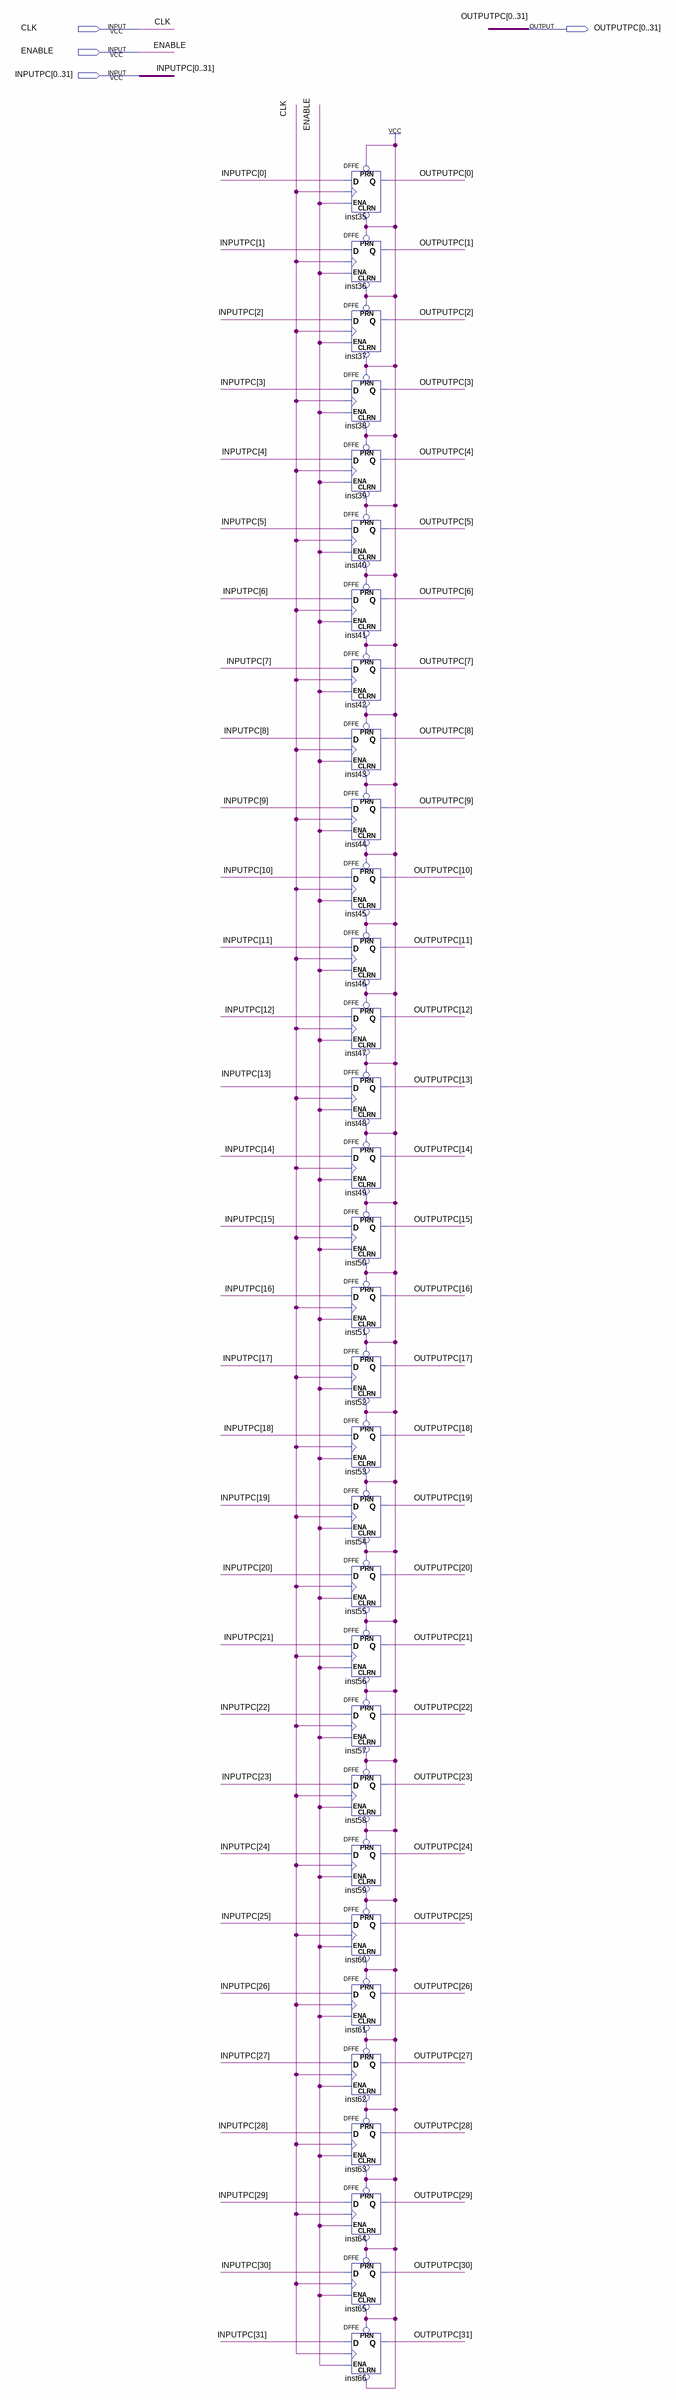
[diagram p0: schematic sheet]
// Quartus schematic PC.bdf as structural Verilog: 32 symbols, 4 pins
module PC (
  input  CLK,
  input  ENABLE,
  input  [0:31] INPUTPC,
  output [0:31] OUTPUTPC
);

  DFFE inst35 (.PRN(1'b1), .CLRN(1'b1), .D(INPUTPC[0]), .CLK(CLK), .ENA(ENABLE), .Q(OUTPUTPC[0]));
  DFFE inst36 (.PRN(1'b1), .CLRN(1'b1), .D(INPUTPC[1]), .CLK(CLK), .ENA(ENABLE), .Q(OUTPUTPC[1]));
  DFFE inst37 (.PRN(1'b1), .CLRN(1'b1), .D(INPUTPC[2]), .CLK(CLK), .ENA(ENABLE), .Q(OUTPUTPC[2]));
  DFFE inst38 (.PRN(1'b1), .CLRN(1'b1), .D(INPUTPC[3]), .CLK(CLK), .ENA(ENABLE), .Q(OUTPUTPC[3]));
  DFFE inst39 (.PRN(1'b1), .CLRN(1'b1), .D(INPUTPC[4]), .CLK(CLK), .ENA(ENABLE), .Q(OUTPUTPC[4]));
  DFFE inst40 (.PRN(1'b1), .CLRN(1'b1), .D(INPUTPC[5]), .CLK(CLK), .ENA(ENABLE), .Q(OUTPUTPC[5]));
  DFFE inst41 (.PRN(1'b1), .CLRN(1'b1), .D(INPUTPC[6]), .CLK(CLK), .ENA(ENABLE), .Q(OUTPUTPC[6]));
  DFFE inst42 (.PRN(1'b1), .CLRN(1'b1), .D(INPUTPC[7]), .CLK(CLK), .ENA(ENABLE), .Q(OUTPUTPC[7]));
  DFFE inst43 (.PRN(1'b1), .CLRN(1'b1), .D(INPUTPC[8]), .CLK(CLK), .ENA(ENABLE), .Q(OUTPUTPC[8]));
  DFFE inst44 (.PRN(1'b1), .CLRN(1'b1), .D(INPUTPC[9]), .CLK(CLK), .ENA(ENABLE), .Q(OUTPUTPC[9]));
  DFFE inst45 (.PRN(1'b1), .CLRN(1'b1), .D(INPUTPC[10]), .CLK(CLK), .ENA(ENABLE), .Q(OUTPUTPC[10]));
  DFFE inst46 (.PRN(1'b1), .CLRN(1'b1), .D(INPUTPC[11]), .CLK(CLK), .ENA(ENABLE), .Q(OUTPUTPC[11]));
  DFFE inst47 (.PRN(1'b1), .CLRN(1'b1), .D(INPUTPC[12]), .CLK(CLK), .ENA(ENABLE), .Q(OUTPUTPC[12]));
  DFFE inst48 (.PRN(1'b1), .CLRN(1'b1), .D(INPUTPC[13]), .CLK(CLK), .ENA(ENABLE), .Q(OUTPUTPC[13]));
  DFFE inst49 (.PRN(1'b1), .CLRN(1'b1), .D(INPUTPC[14]), .CLK(CLK), .ENA(ENABLE), .Q(OUTPUTPC[14]));
  DFFE inst50 (.PRN(1'b1), .CLRN(1'b1), .D(INPUTPC[15]), .CLK(CLK), .ENA(ENABLE), .Q(OUTPUTPC[15]));
  DFFE inst51 (.PRN(1'b1), .CLRN(1'b1), .D(INPUTPC[16]), .CLK(CLK), .ENA(ENABLE), .Q(OUTPUTPC[16]));
  DFFE inst52 (.PRN(1'b1), .CLRN(1'b1), .D(INPUTPC[17]), .CLK(CLK), .ENA(ENABLE), .Q(OUTPUTPC[17]));
  DFFE inst53 (.PRN(1'b1), .CLRN(1'b1), .D(INPUTPC[18]), .CLK(CLK), .ENA(ENABLE), .Q(OUTPUTPC[18]));
  DFFE inst54 (.PRN(1'b1), .CLRN(1'b1), .D(INPUTPC[19]), .CLK(CLK), .ENA(ENABLE), .Q(OUTPUTPC[19]));
  DFFE inst55 (.PRN(1'b1), .CLRN(1'b1), .D(INPUTPC[20]), .CLK(CLK), .ENA(ENABLE), .Q(OUTPUTPC[20]));
  DFFE inst56 (.PRN(1'b1), .CLRN(1'b1), .D(INPUTPC[21]), .CLK(CLK), .ENA(ENABLE), .Q(OUTPUTPC[21]));
  DFFE inst57 (.PRN(1'b1), .CLRN(1'b1), .D(INPUTPC[22]), .CLK(CLK), .ENA(ENABLE), .Q(OUTPUTPC[22]));
  DFFE inst58 (.PRN(1'b1), .CLRN(1'b1), .D(INPUTPC[23]), .CLK(CLK), .ENA(ENABLE), .Q(OUTPUTPC[23]));
  DFFE inst59 (.PRN(1'b1), .CLRN(1'b1), .D(INPUTPC[24]), .CLK(CLK), .ENA(ENABLE), .Q(OUTPUTPC[24]));
  DFFE inst60 (.PRN(1'b1), .CLRN(1'b1), .D(INPUTPC[25]), .CLK(CLK), .ENA(ENABLE), .Q(OUTPUTPC[25]));
  DFFE inst61 (.PRN(1'b1), .CLRN(1'b1), .D(INPUTPC[26]), .CLK(CLK), .ENA(ENABLE), .Q(OUTPUTPC[26]));
  DFFE inst62 (.PRN(1'b1), .CLRN(1'b1), .D(INPUTPC[27]), .CLK(CLK), .ENA(ENABLE), .Q(OUTPUTPC[27]));
  DFFE inst63 (.PRN(1'b1), .CLRN(1'b1), .D(INPUTPC[28]), .CLK(CLK), .ENA(ENABLE), .Q(OUTPUTPC[28]));
  DFFE inst64 (.PRN(1'b1), .CLRN(1'b1), .D(INPUTPC[29]), .CLK(CLK), .ENA(ENABLE), .Q(OUTPUTPC[29]));
  DFFE inst65 (.PRN(1'b1), .CLRN(1'b1), .D(INPUTPC[30]), .CLK(CLK), .ENA(ENABLE), .Q(OUTPUTPC[30]));
  DFFE inst66 (.PRN(1'b1), .CLRN(1'b1), .D(INPUTPC[31]), .CLK(CLK), .ENA(ENABLE), .Q(OUTPUTPC[31]));
endmodule
